# Altium schematic sheet MSP430.SchDoc
size Letter; ApprovedBy: M. en C. Fernando Bolaños; CheckedBy: M. en C. José Alberto Balderas Castillo (CID); Author: M. en C. José Alberto Balderas Castillo (CID); Revision: v1; NombreTarjeta: TELCOMGPRS-v1; NumeroDeHoja: 7 de 7; NombreBloque: Microcontrolador MSP430; FechaDiseno: 02-Junio-2015; FechaRevision: 05-Junio-2015; FechaAprobacion: 16-Junio-2015; TamanoHoja: Carta; NombreProyecto: Telemetria GPRS de Bajo Consumo de Energia
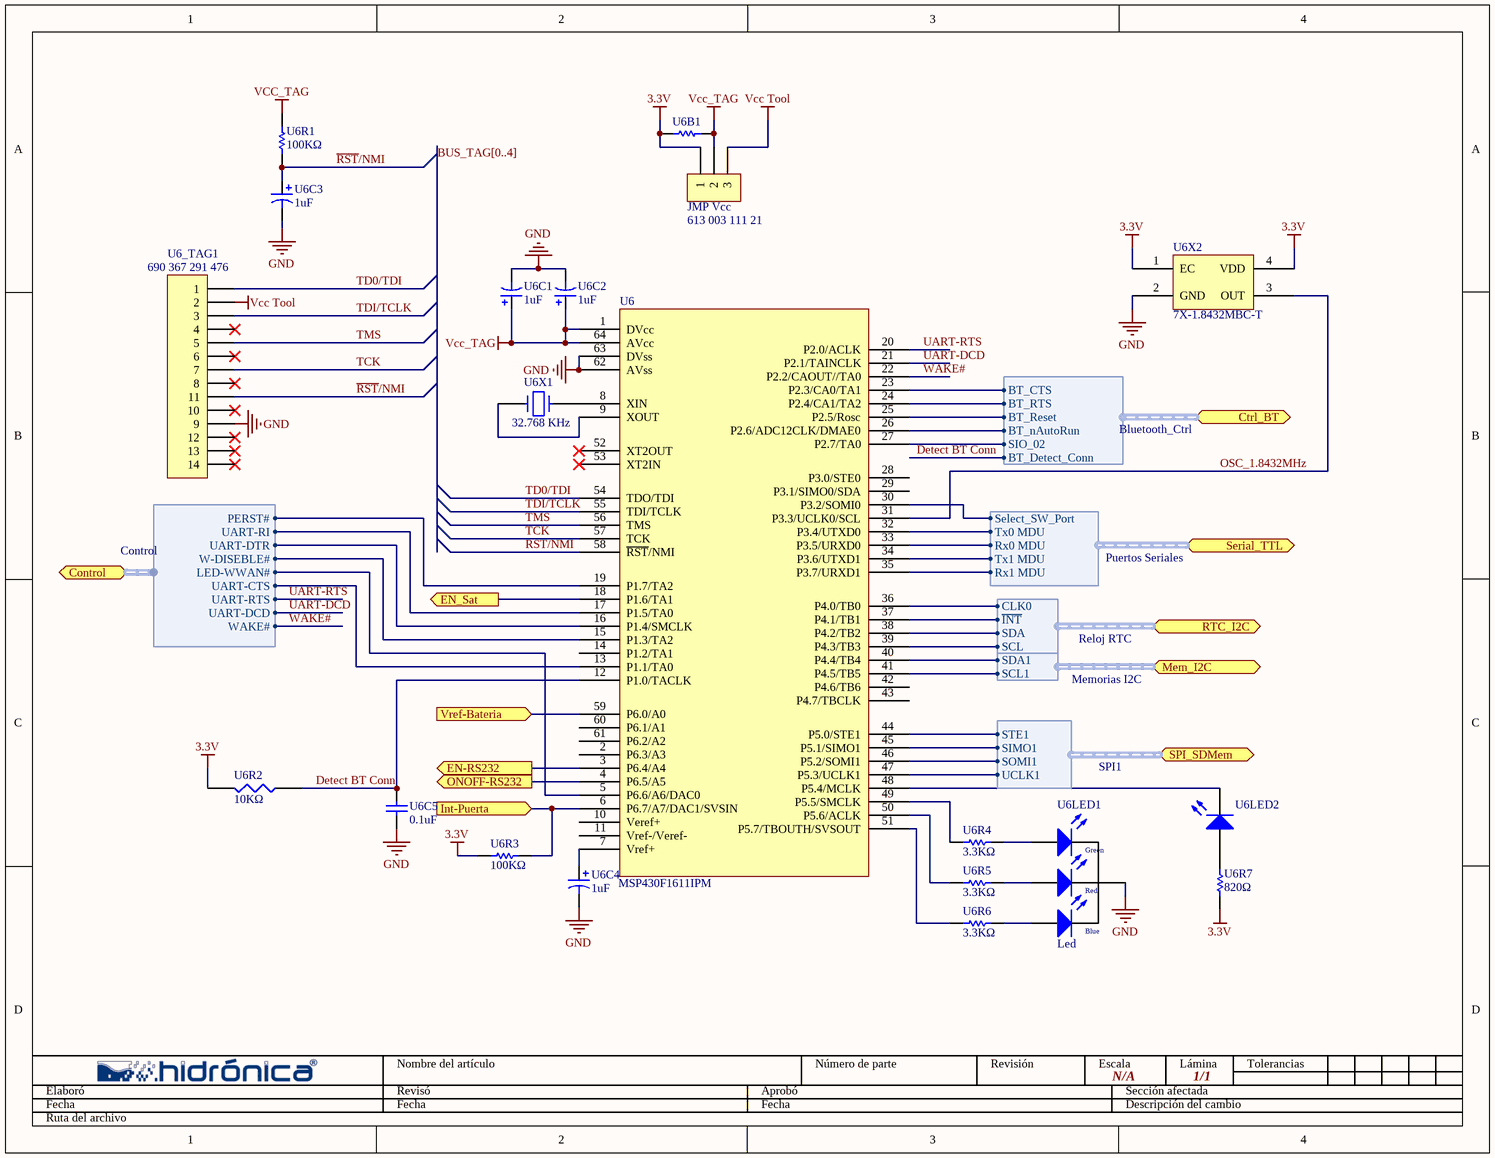
[diagram p0: MSP430.SchDoc]

## Parts
JMP_Vcc  613 003 111 21  [HDR1X3]
U6  MSP430F1611IPM  [LQFP-64]
U6_TAG1  690 367 291 476  [690367291476]
U6B1  (no value)  [Bypass Bridge]
U6C1  1uF  [0805-tan]
U6C2  1uF  [0805-tan]
U6C3  1uF  [0805-tan]
U6C4  1uF  [0805-tan]
U6C5  0.1uF  [0603 - CAP]
U6LED1  Led  [HDR1X4]
U6LED2  LED2  [0805-LEDG]  (value not drawn)
U6R1  100KΩ  [0805-RES]
U6R2  10KΩ  [0805-RES]
U6R3  100KΩ  [0805-RES]
U6R4  3.3KΩ  [0805-RES]
U6R5  3.3KΩ  [0805-RES]
U6R6  3.3KΩ  [0805-RES]
U6R7  820Ω  [0805-RES]
U6X1  32.768 KHz  [XTAL SMD 3.2 x 1.5]
U6X2  7X-1.8432MBC-T  [7X-1.8432MBC-T]

## Ports
Control (harness Control), Ctrl_BT (harness Bluetooth_Ctrl), EN-RS232 (out), EN_Sat (out), Int-Puerta (in), Mem_I2C (harness Memorias I2C), ONOFF-RS232 (out), RTC_I2C (harness Reloj RTC), Serial_TTL (harness Puertos Seriales), SPI_SDMem (harness SPI1), Vref-Bateria (in)

## Harnesses
Memorias I2C: SDA1, SCL1
Reloj RTC: CLK0, ~{INT}, SDA, SCL
Puertos Seriales: Select_SW_Port, Tx0 MDU, Rx1 MDU, Rx0 MDU, Tx1 MDU
Control: UART-RI, UART-DTR, PERST#, W-DISEBLE#, LED-WWAN#, UART-CTS, UART-RTS, UART-DCD, WAKE#
SPI1: STE1, SIMO1, SOMI1, UCLK1
Bluetooth_Ctrl: BT_Reset, BT_nAutoRun, SIO_02, BT_RTS, BT_CTS, BT_Detect_Conn

## Nets
3.3V: JMP_Vcc.1 U6B1.2 U6R2.2 U6R3.2 U6R7.2 U6X2.1(EC) U6X2.4(VDD)
GND: U6.62(AVss) U6.63(DVss) U6_TAG1.9 U6C1.2 U6C2.2 U6C3.2 U6C4.2 U6C5.2 U6LED1.1(A) U6X2.2(GND)
Vcc Tool: JMP_Vcc.3 U6_TAG1.2
VCC_TAG: JMP_Vcc.2 U6.1(DVcc) U6.64(AVcc) U6B1.1 U6C1.1 U6C2.1 U6R1.2
Detect BT Conn: U6.12(P1.0/TACLK) U6C5.1 U6R2.1 ; port Ctrl_BT.BT_Detect_Conn
EN-RS232: U6.3(P6.4/A4) ; port EN-RS232
EN_Sat: U6.18(P1.6/TA1) ; port EN_Sat
Int-Puerta: U6.6(P6.7/A7/DAC1/SVSIN) U6R3.1 ; port Int-Puerta
ONOFF-RS232: U6.4(P6.5/A5) ; port ONOFF-RS232
OSC_1.8432MHz: U6.31(P3.3/UCLK0/SCL) U6X2.3(OUT)
~{RST}/NMI: U6.58(~{RST}/NMI) U6_TAG1.11 U6C3.1 U6R1.1
TCK: U6.57(TCK) U6_TAG1.7
TD0/TDI: U6.54(TDO/TDI) U6_TAG1.1
TDI/TCLK: U6.55(TDI/TCLK) U6_TAG1.3
TMS: U6.56(TMS) U6_TAG1.5
UART-DCD: U6.21(P2.1/TAINCLK) ; port Control.UART-DCD
UART-RTS: U6.20(P2.0/ACLK) ; port Control.UART-RTS
Vref-Bateria: U6.59(P6.0/A0) ; port Vref-Bateria
WAKE#: U6.22(P2.2/CAOUT//TA0) ; port Control.WAKE#
NetU6_5: U6.5(P6.6/A6/DAC0) ; port Control.LED-WWAN#
NetU6_7: U6.7(Vref+) U6C4.1
NetU6_8: U6.8(XIN) U6X1.2
NetU6_9: U6.9(XOUT) U6X1.1
NetU6_13: U6.13(P1.1/TA0) ; port Control.UART-CTS
NetU6_15: U6.15(P1.3/TA2) ; port Control.W-DISEBLE#
NetU6_16: U6.16(P1.4/SMCLK) ; port Control.UART-DTR
NetU6_17: U6.17(P1.5/TA0) ; port Control.UART-RI
NetU6_19: U6.19(P1.7/TA2) ; port Control.PERST#
NetU6_23: U6.23(P2.3/CA0/TA1) ; port Ctrl_BT.BT_CTS
NetU6_24: U6.24(P2.4/CA1/TA2) ; port Ctrl_BT.BT_RTS
NetU6_25: U6.25(P2.5/Rosc) ; port Ctrl_BT.BT_Reset
NetU6_26: U6.26(P2.6/ADC12CLK/DMAE0) ; port Ctrl_BT.BT_nAutoRun
NetU6_27: U6.27(P2.7/TA0) ; port Ctrl_BT.SIO_02
NetU6_30: U6.30(P3.2/SOMI0) ; port Serial_TTL.Select_SW_Port
NetU6_32: U6.32(P3.4/UTXD0) ; port Serial_TTL.Tx0 MDU
NetU6_33: U6.33(P3.5/URXD0) ; port Serial_TTL.Rx0 MDU
NetU6_34: U6.34(P3.6/UTXD1) ; port Serial_TTL.Tx1 MDU
NetU6_35: U6.35(P3.7/URXD1) ; port Serial_TTL.Rx1 MDU
NetU6_36: U6.36(P4.0/TB0) ; port RTC_I2C.CLK0
NetU6_37: U6.37(P4.1/TB1) ; port RTC_I2C.~{INT}
NetU6_38: U6.38(P4.2/TB2) ; port RTC_I2C.SDA
NetU6_39: U6.39(P4.3/TB3) ; port RTC_I2C.SCL
NetU6_40: U6.40(P4.4/TB4) ; port Mem_I2C.SDA1
NetU6_41: U6.41(P4.5/TB5) ; port Mem_I2C.SCL1
NetU6_44: U6.44(P5.0/STE1) ; port SPI_SDMem.STE1
NetU6_45: U6.45(P5.1/SIMO1) ; port SPI_SDMem.SIMO1
NetU6_46: U6.46(P5.2/SOMI1) ; port SPI_SDMem.SOMI1
NetU6_47: U6.47(P5.3/UCLK1) ; port SPI_SDMem.UCLK1
NetU6_48: U6.48(P5.4/MCLK) U6LED2.2(K)
NetU6_49: U6.49(P5.5/SMCLK) U6R4.2
NetU6_50: U6.50(P5.6/ACLK) U6R5.2
NetU6_51: U6.51(P5.7/TBOUTH/SVSOUT) U6R6.2
NetU6LED1_2: U6LED1.2(C3) U6R6.1
NetU6LED1_3: U6LED1.3(C2) U6R5.1
NetU6LED1_4: U6LED1.4(C1) U6R4.1
NetU6LED2_1: U6LED2.1(A) U6R7.1

Not connected (* = marked no-connect by the designer): U6 2(P6.3/A3) 10(Veref+) 11(Vref-/Veref-) 14(P1.2/TA1) 28(P3.0/STE0) 29(P3.1/SIMO0/SDA) 42(P4.6/TB6) 43(P4.7/TBCLK) 52(XT2OUT)* 53(XT2IN)* 60(P6.1/A1) 61(P6.2/A2); U6_TAG1 4* 6* 8* 10* 12* 13* 14*

## Buses and harness runs
bus BUS_TAG[0..4]

## Notes on the sheet
- Elaboró
- Fecha
- Nombre del artículo
- Revisó
- Aprobó
- Número de parte
- Revisión
- Escala
- N/A
- Sección afectada
- Descripción del cambio
- Lámina
- 1/1
- Tolerancias
- Ruta del archivo
- (in symbol RGB-Catodo) Green; Red; Blue

## Library data of the parts
JMP_Vcc = CON3: 2.54mm THT Pin Header WR-PHD 3 terminales; Manufacturer: Wurth Elektronik; Manufacturer Part Number: 613 003 111 21; Supplier Part Number 1: 613 003 111 21; Supplier 1: Wurth Elektronik
U6 = MSP430F16xx: IC MCU 16BIT 48K FLASH 64-LQFP; Manufacturer: Texas Instruments; Manufacturer Part Number: MSP430F1611IPM; Supplier 1: Digi-Key; Supplier Part Number 1: 296-17205-ND
U6_TAG1 = CON14: Female SMT Straight Connector with Latch and with Polarization WR-MM 14-Pin; Contraparte: 690 157 001 472; Manufacturer: Wurth Elektronik; Supplier Part Number 1: 690 367 291 476; Supplier 1: Wurth Elektronik; Manufacturer Part Number: 690 367 291 476
U6B1 = Res1: No Aplica; Numero de Parte: No Aplica
U6C1-U6C4 = Cap Pol1: AVX - TACU105M016X - CAP TANT 1UF, 16V, 7.5OHM, 0805; Manufacturer: AVX Corporation; Manufacturer Part Number: TAJR105K010RNJ; Value: 1uF; Supplier 1: Digi-Key; Supplier Part Number 1: 478-3278-1-ND
U6C5 = Cap: CAP CERAMIC 0.1UF, 25V, X7R, 0603; Manufacturer Part Number: CGJ3E2X7R1E104K080AA; Manufacturer: TDK Corporation; Value: 0.1uF; Supplier 1: Digi-Key; Supplier Part Number 1: 445-8129-1-ND
U6LED1 = RGB-Catodo: KINGBRIGHT  L-154A4SURKQBDZGW  LED, RGB, Rojo, Verde, Azul, Through Hole, T-1 3/4 (5mm), 60 °, Abovedada, R 20mA, G 20mA, B 20mA, Common Cathode; Supplier 1: Newark; Supplier Part Number 1: 66W1973; Manufacturer: KINGBRIGHT; Manufacturer Part Number: L-154A4SURKQBDZGW
U6LED2 = LED2: WL-SMCW SMD mono-color chip LED waterclear 0805 Green; Manufacturer: WURTH ELEKTRONIK; Manufacturer Part Number: 150080GS75000; Supplier 2: Digi-Key; Supplier Part Number 2: 732-4983-1-ND; Supplier 3: Newark; Supplier Part Number 3: 95W3800; Supplier 1: Wurth Elektronik; Supplier Part Number 1: 150080GS75000
U6R1 U6R3 = Res1: RES SMD 100K OHM 5% 1/2W 0805; Manufacturer: Panasonic; Manufacturer Part Number: ERJ-P06J104V; Value: 100KΩ; Supplier 1: Digi-Key; Supplier Part Number 1: P100KADCT-ND
U6R2 = RES1: 10 kOhms ±5% 0.125W, 1/8W Chip Resistor 0805; Manufacturer Part Number: RC0805JR-0710KL; Manufacturer: Yageo; Value: 10KΩ; Supplier 1: Digi-Key; Supplier Part Number 1: 311-10KARCT-ND
U6R4-U6R6 = Res1: RES SMD 3.3K OHM 5% 1/8W 0805; Manufacturer: Panasonic Electronic Components; Manufacturer Part Number: ERJ-6GEYJ332V; Value: 3.3KΩ; Supplier 1: Digi-Key; Supplier Part Number 1: P3.3KACT-ND
U6R7 = Res1: PANASONIC ELECTRONIC COMPONENTS  ERJ-6GEYJ821V  Resistencia SMD Chip, Película Gruesa, 820 ohm, 150 V, 0805 [2012 Metric], 125 mW, ± 5%; Value: 820Ω; Supplier 2: Newark; Supplier Part Number 2: 65T8844; Manufacturer: PANASONIC ELECTRONIC COMPONENTS; Manufacturer Part Number: ERJ-6GEYJ821V; Supplier 1: Digi-Key; Supplier Part Number 1: P820ACT-ND
U6X1 = CRYSTAL: CRYSTAL 32.7680KHZ 12.5PF SMD  -40°C ~ 85°C; Manufacturer: EPSON; Manufacturer Part Number: FC-135 32.768KA-A3; Supplier 1: Digi-Key; Supplier Part Number 1: SE2413CT-ND
U6X2 = 7X-1.8432MBC-T: 7X-1.8432MBC-T -  Oscilador, 1.8432 MHz, 100 ppm, SMD, 5mm x 3.2mm, CMOS, 3.3 V, Serie 7X; Manufacturer: TXC; Manufacturer Part Number: 7X-1.8432MBC-T; Supplier 1: Newark; Supplier Part Number 1: 29X6515